# EAGLE design Le1 Mini (EAGLE 8.0.1)
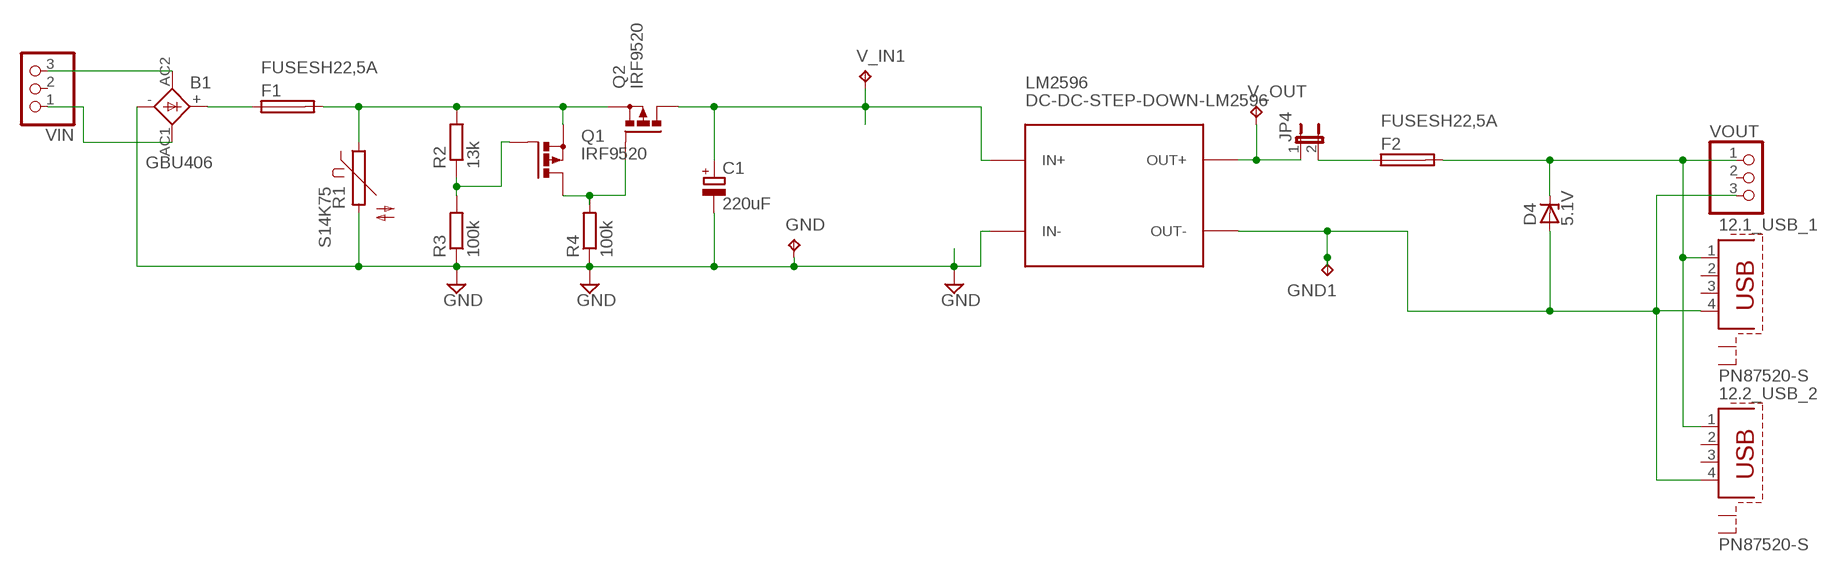
[diagram p0: schematic, sheet 1]

## Parts
12.1_USB_1  PN87520-S  [PN87520-S]
12.2_USB_2  PN87520-S  [PN87520-S]
B1  GBU406  GBU4  [GBU4S]
C1  220uF  CPOL-EUE3.5-10  [E3,5-10]
D4  5.1V  ZPD  [DO35Z10]
F1  FUSESH22,5A  [SH22,5A]
F2  FUSESH22,5A  [SH22,5A]
GND  TPPAD1-13  [P1-13]
GND1  TPPAD1-13  [P1-13]
JP4  JP1E  [JP1]
LM2596  DC-DC-STEP-DOWN-LM2596  [DC-DC-STEP-DOWN-LM2596]
Q1  IRF9520  PMOSFET_PTO220BV  [TO220BV]
Q2  IRF9520  PMOSFET_PTO220BV  [TO220BV]
R1  S14K75  S14K17  [S14K17]
R2  13k  R-EU_0207/10  [0207/10]
R3  100k  R-EU_0207/10  [0207/10]
R4  100k  R-EU_0207/10  [0207/10]
V_IN1  TPPAD1-13  [P1-13]
V_OUT  TPPAD1-13  [P1-13]
VIN  PINHD-1X3  [1X03]
VOUT  PINHD-1X3  [1X03]

## Nets
GND: B1.- C1.- GND.TP LM2596.IN- R1.2 R3.1 R4.1
N$1: B1.+ F1.1
N$3: Q1.1(G) R2.1 R3.2
N$7: B1.AC1(AC2) VIN.1
N$9: B1.AC2(AC1) VIN.3
N$10: 12.1_USB_1.4 12.2_USB_2.4 D4.A GND1.TP LM2596.OUT- VOUT.3
N$15: JP4.1 LM2596.OUT+ V_OUT.TP
N$16: F2.1 JP4.2
Q2_GATE: Q1.2(D) Q2.1(G) R4.2
VIN_PROTECTED: C1.+ LM2596.IN+ Q2.2(D) V_IN1.TP
VIN_UNPROTECTED: F1.2 Q1.3(S) Q2.3(S) R1.1 R2.2
VOUT_FINAL: 12.1_USB_1.1 12.2_USB_2.1 D4.C F2.2 VOUT.1
Unconnected: 12.1_USB_1.2 12.1_USB_1.3 12.1_USB_1.S1 12.1_USB_1.S2 12.2_USB_2.2 12.2_USB_2.3 12.2_USB_2.S1 12.2_USB_2.S2 VIN.2 VOUT.2

## Library data of the parts
12.1_USB_1 12.2_USB_2 = con-berg:PN87520-S; OC_FARNELL: unknown; OC_NEWARK: unknown
B1 = rectifier:GBU4: GENERAL INSTRUMENT RECTIFIER
C1 = resistor:CPOL-EU: POLARIZED CAPACITOR, European symbol
D4 = diode:ZPD: Z DIODE 500 mW
F1 F2 = fuse:FUSE: Fuse; OC_FARNELL: unknown; OC_NEWARK: unknown
GND GND1 V_IN1 V_OUT = testpad:TP: Test pad
JP4 = jumper:JP1E: JUMPER
LM2596 = diy-modules:DC-DC-STEP-DOWN-LM2596: DC/DC Step-Down Regulator based on LM2596-ADJ chip LM2596 datasheet available here: http://www.ti.com/lit/ds/symlink/lm2596.pdf Click here to find device on ebay.com <http://www.ebay.com/sch/lm2596+power+regulator>
Q1 Q2 = Samson:PMOSFET_P: Power MOSFET P-Channel
R1 = varistor:S14K17: VARISTOR
R2-R4 = resistor:R-EU_: RESISTOR, European symbol
VIN VOUT = pinhead:PINHD-1X3: PIN HEADER

## Module BB1
Ports: 

### Library data of the parts

## Board
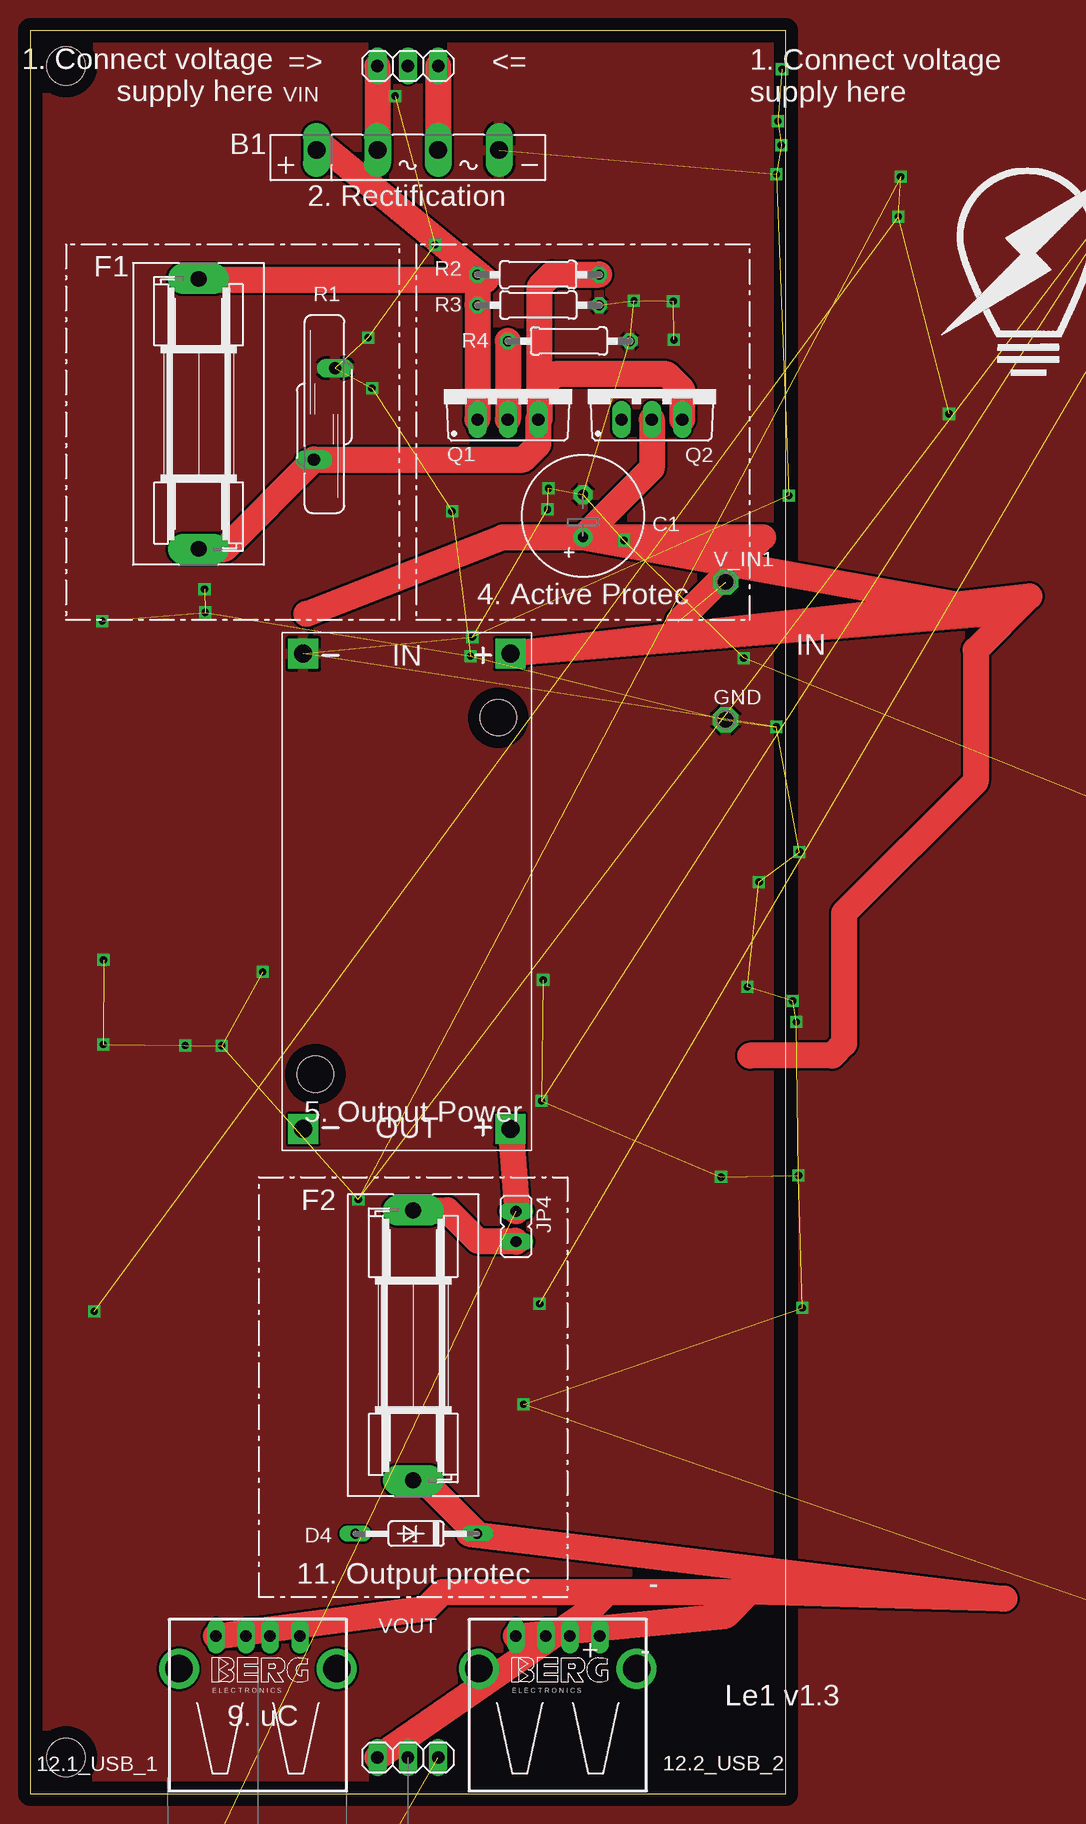
[diagram p1: board, top side]
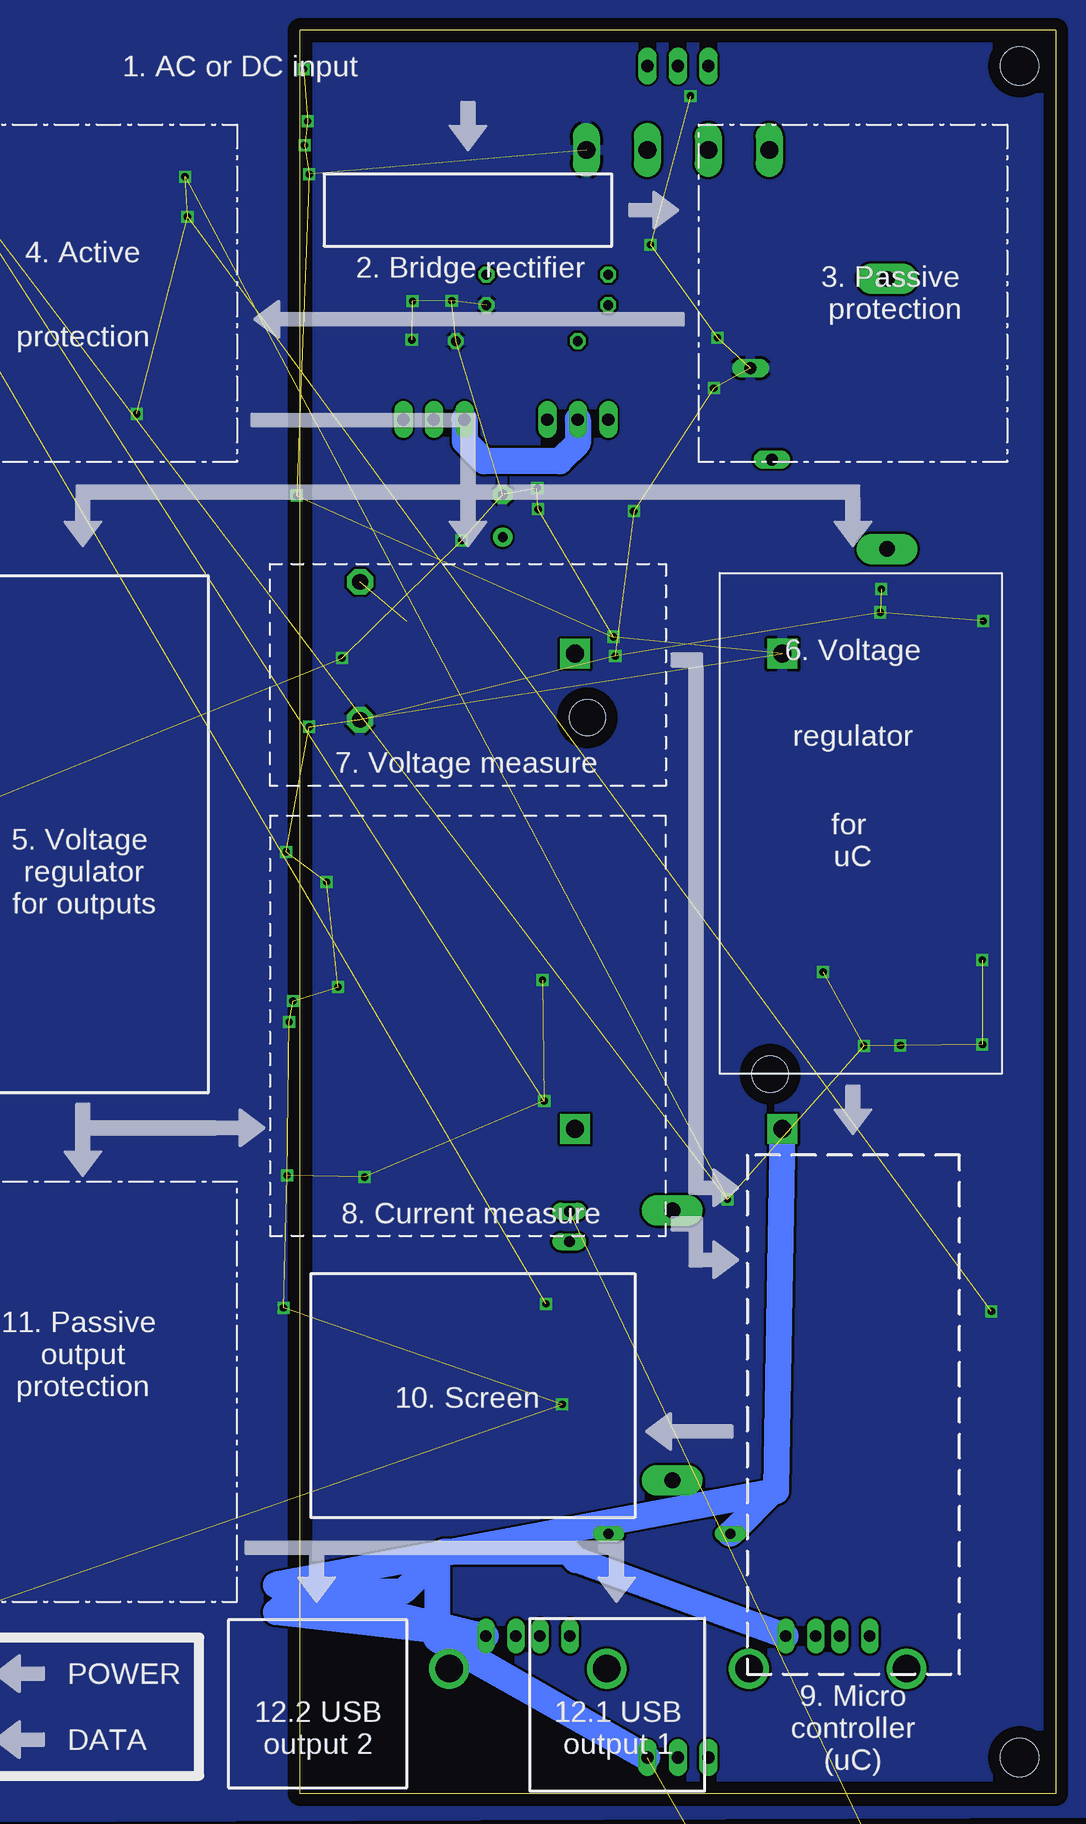
[diagram p2: board, bottom side, seen from below]

Size 63 x 147 mm. Coordinates in mm from the lower left corner, seen from the top.
Outline: 0,147 0,0 63,0 63,147 0,147
Copper layers (1*16): Top 0.035mm / dielectric 1.5mm / Bottom 0.035mm
Design rules "default *": minimum track width 10mil, minimum drill 20mil, track to track 8mil, track to pad 8mil, pad to pad 8mil, via to via 8mil, smd to smd 8mil, copper to edge 40mil, drill to drill 8mil, minimum pad ring 10mil, minimum via ring 8mil, stop-mask expansion 4mil, vias tented up to drill 0mil, thermal gap 10mil
Holes 3.2 mm at 95,144 95,3 3,3 3,144

### Footprints (pad centres in the part's own frame; a part is rotated, then mirrored left to right if it is on the bottom)
PN87520-S = drill 0.95 long: 1 -3.5,2.71; 2 -1,2.71; 3 1,2.71; 4 3.5,2.71 | drill 2.3 pad 2.9: S1 -6.57,0; S2 6.57,0
GBU4S = drill 1.499 long: + 7.62,0; - -7.62,0; AC1 2.54,0; AC2 -2.54,0
E3,5-10 = drill 0.813 pad 1.6: + -1.778,0 | drill 0.813 pad 1.6 octagon: - 1.778,0
DO35Z10 = drill 0.813 long: A 5.08,0; C -5.08,0
SH22,5A = drill 1.321 pad 2.54 long: 1 -11.252,0; 2 11.252,0
P1-13 = drill 1.321 pad 2.159 octagon: TP 0,0
JP1 = drill 0.914 long: 1 0,-1.27; 2 0,1.27
DC-DC-STEP-DOWN-LM2596 = drill 1.5 pad 2.5 square: IN+ -19.812,8.636; IN- -19.812,-8.636; OUT+ 19.812,8.636; OUT- 19.812,-8.636 | hole 3: -14.478,7.62; 15.24,-7.62
TO220BV = drill 1.016 long: 1 -2.54,-2.54; 2 0,-2.54; 3 2.54,-2.54
S14K17 = drill 1.016 long: 1 -0.889,-3.81; 2 0.889,3.81
0207/10 = drill 0.813 octagon: 1 -5.08,0; 2 5.08,0
1X03 = drill 1.016 long: 1 -2.54,0; 2 0,0; 3 2.54,0

### Placement (x,y rotation side)
12.1_USB_1  19,10.4 0 top
12.2_USB_2  44,10.4 0 top
B1  31.5,137 180 top
C1  46.1,106.5 90 top
D4  32.2,21.66 180 top
F1  14.05,115 270 top
F2  31.95,37.36 270 top
GND  58,89.5 0 top
GND1  5.38,-46.96 0 top  (outside the outline)
JP4  40.54,47.27 180 top
LM2596  31.42,75.2 270 top
Q1  39.84,117.07 0 top
Q2  51.84,117.07 0 top
R1  24.55,115 0 top
R2  42.38,126.61 0 top
R3  42.38,124.07 180 top
R4  44.93,121.07 180 top
V_IN1  58,101 0 top
V_OUT  5.38,-25.37 0 top  (outside the outline)
VIN  31.5,144 0 top
VOUT  31.5,3 0 top

### Tracks (layer width: path | path; a pad name or v marks a point on that pad's centre or on a via)
GND  (via drill 0.6)  (58 unrouted)
  other vias: 62.63,137.39 53.63,124.4 53.68,121.17 95.79,131.68 93.01,136.12 62.37,139.39 50.35,124.45 95.83,129.12 42.5,40.8 28.19,121.35 63.27,108.18 28.51,117.14 42.64,57.73 12.93,62.35 63.9,64.32 14.61,98.46 14.54,100.39 43.22,108.8 59.82,67.24 63.59,66.07 15.99,62.33 43.14,107.05 49.52,104.46 19.4,68.47 42.79,67.82 57.62,51.38 64.08,51.51 95.09,13.68 41.14,32.43 95.14,9.31 72.59,134.76 5.35,40.2 72.38,131.44 27.37,49.52 76.63,115 64.38,40.48 59.51,94.66 94.66,80.48 94.51,67.73 62.22,88.92 36.72,94.81 62.22,134.99 35.17,106.88 36.88,96.42 60.78,75.98 64.16,78.49 33.78,129.11 62.71,143.72 30.45,141.49 6.03,97.73 6.13,69.48 6.1,62.45
  pour Bottom: 98.77,151.26 99,-2.02 -3.07,-1.61 -4.71,153.77
  pour Top: 99.46,150.75 99,-2.26 -4.63,-2.46 -5.01,152.59
N$1
  Top 2.184: B1.+ 23.88,137.79 38.01,126.16 13.64,126.16 F1.1
N$3
  Top 2.184: R2.1 R3.2 Q1.1
N$7
  Top 2.184: VIN.1 B1.AC1
N$9
  Top 2.184: VIN.3 B1.AC2
N$10  (1 unrouted)
  Bottom 2.184: 12.1_USB_1.4 40,19.46 40.67,20.13 51.11,20.13 51.59,19.65 | 51.59,19.65 51.59,13.05 VOUT.3 51.64,12.9 | LM2596.OUT- 23.32,25.46 | 23.32,25.46 D4.A | 23.32,25.46 23.32,25.2 65,17.38 12.2_USB_2.4 65,15.11 63.25,16.87 54.37,16.87 51.59,19.65
N$15  (1 unrouted)
  Top 2.184: LM2596.OUT+ 40.59,48.59 JP4.1
N$16
  Top 2.184: F2.1 34.81,48.61 37.34,46.08 40.46,46.08 JP4.2
Q2_GATE
  Top 2.184: R4.2 Q1.2
  Bottom 2.184: Q1.2 39.84,112.57 41.35,111.06 47.62,111.06 49.26,112.7 49.26,114.49 Q2.1
VIN_PROTECTED  (1 unrouted)
  Top 2.184: C1.+ 61.11,104.72 54.08,97.69 | C1.+ 39.44,104.72 23.03,98.32 | C1.+ 81.1,98.45 LM2596.IN+ 83.33,99.81 78.84,95.33 78.84,84.35 67.87,73.38 67.87,62.51 66.88,61.52 60.06,61.52 | Q2.2 51.84,110.46 C1.+
VIN_UNPROTECTED
  Top 2.184: R2.2 43.49,126.61 42.48,125.6 42.48,117.04 | 42.48,117.04 42.48,114.63 Q1.3 42.39,112.45 41.13,111.19 R1.1 16.22,103.75 F1.2 | Q2.3 54.38,117.02 53.09,118.31 43.75,118.31 42.48,117.04
VOUT_FINAL
  Top 2.184: 48.17,16.8 59.97,16.8 | 48.17,16.8 34.38,16.8 33,15.42 12.1_USB_1.1 | 12.2_USB_2.1 58,14.83 59.97,16.8 | VOUT.1 46.46,15.09 48.17,16.8 | 59.97,16.8 81.25,16.24 36.63,21.66 D4.C 32.83,26.1 F2.2

### Text on the board
tPlace: IN | OUT | Le1 v1.3 | 9. uC
bPlace: 1. AC or DC input | 4. Active | 2. Bridge rectifier | 3. Passive / protection | protection | 6. Voltage | regulator | 7. Voltage measure | for / uC | 5. Voltage / regulator / for outputs | 8. Current measure | 11. Passive / output / protection | 10. Screen | POWER | 9. Micro / controller / (uC) | 12.1 USB / output 1 | 12.2 USB / output 2 | DATA
tNames: 1. Connect voltage / supply here | => | <= | 1. Connect voltage / supply here | 2. Rectification | 4. Active Protec | 5. Output Power | 11. Output protec | - | + | -